# EAGLE schematic itsybitsymo (EAGLE 6.4)
COMPANY: ADAFRUIT INDUSTRIES; DRAWN: KTOWN; REV: B
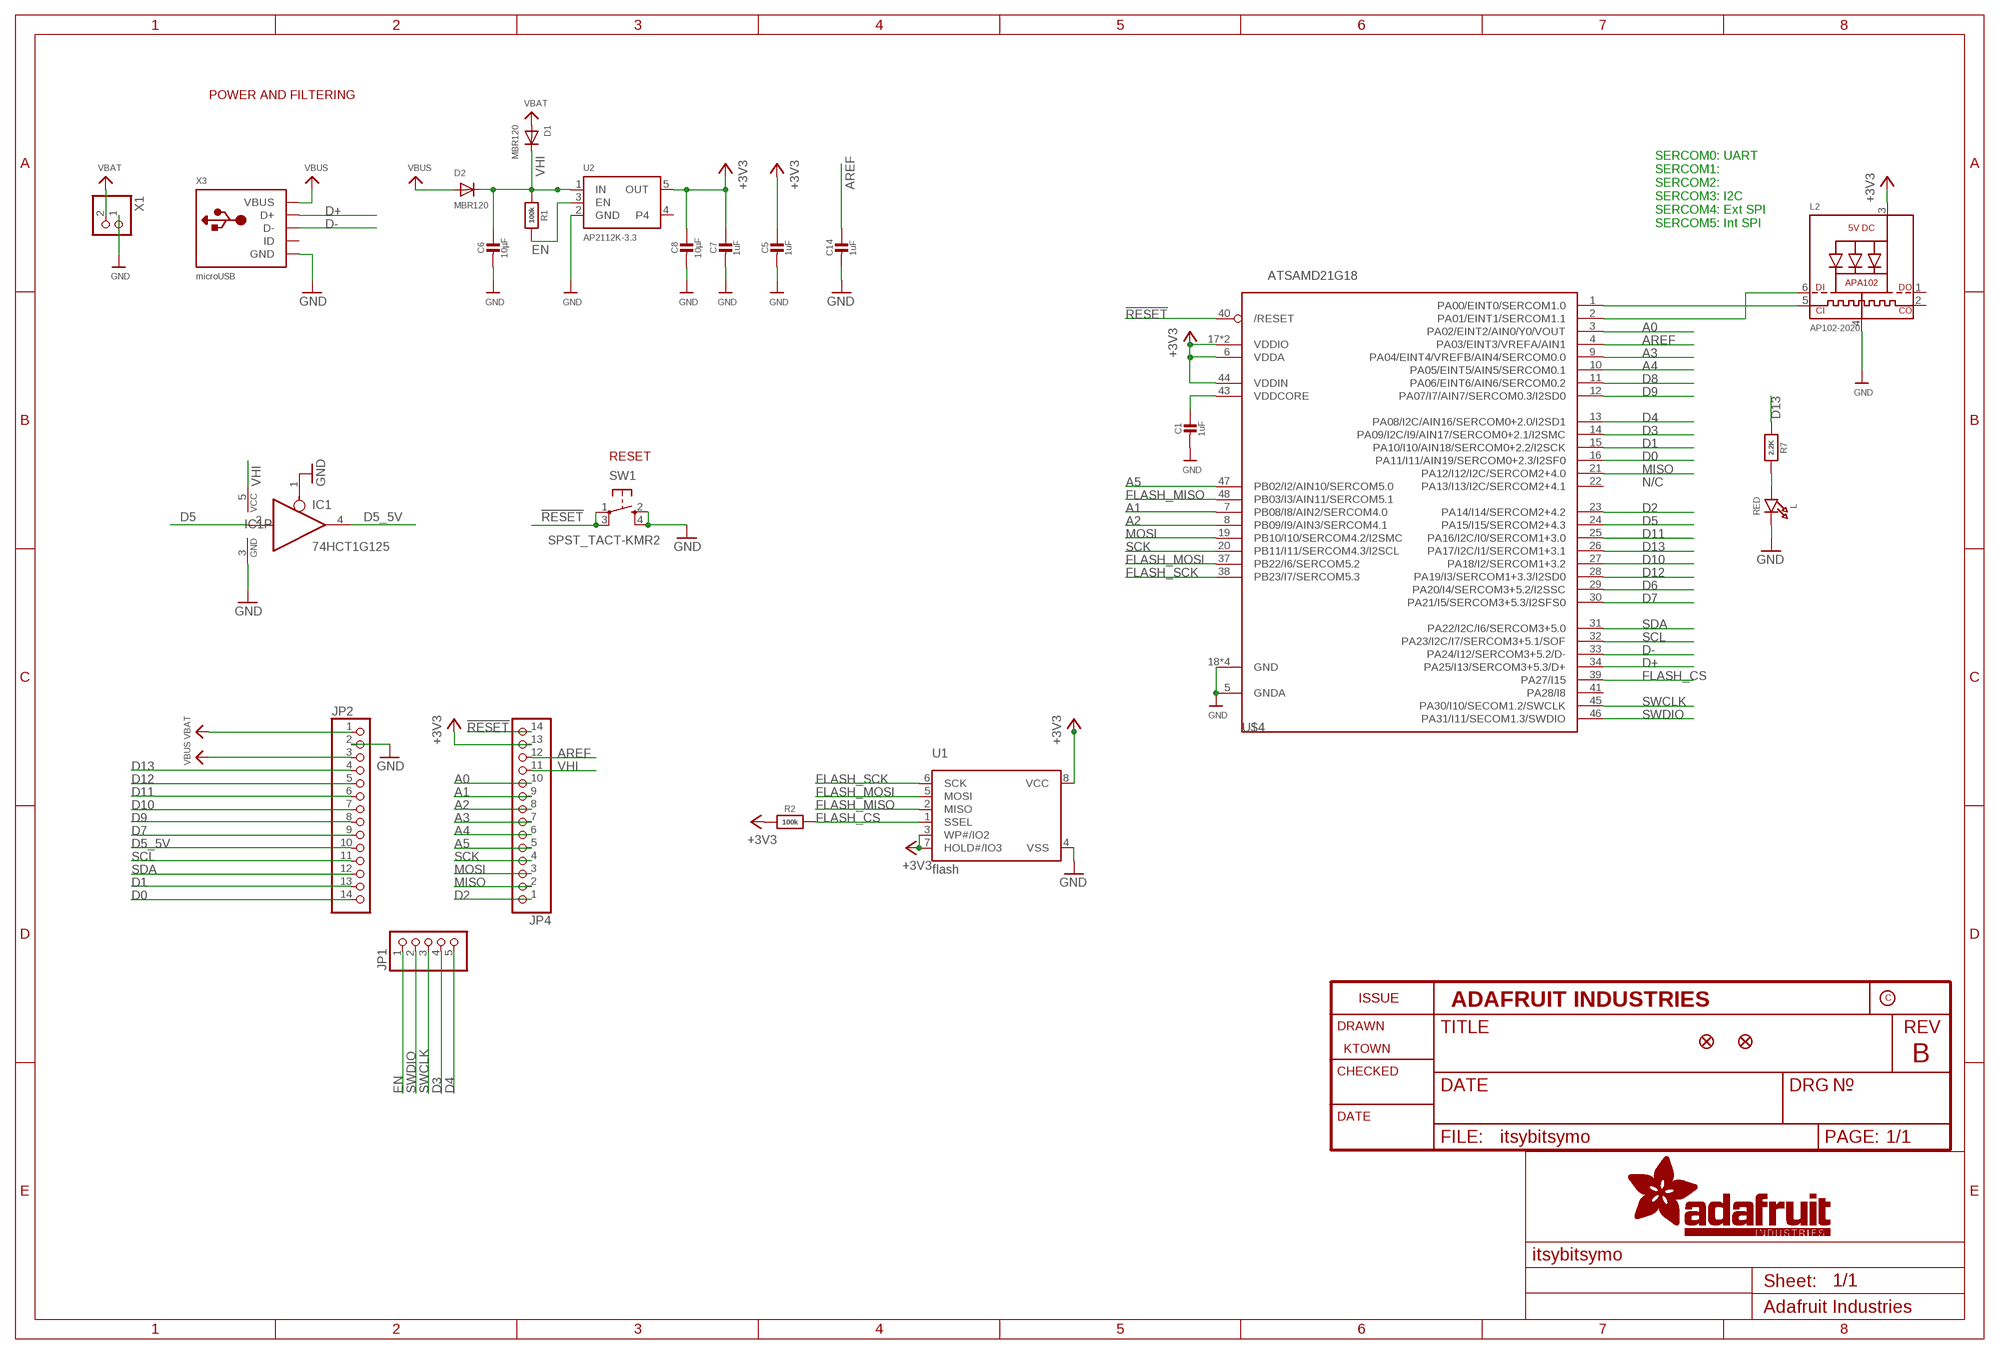
[diagram p0: schematic, sheet 1]

## Parts
C1  1uF  CAP_CERAMIC0603_NO  [0603-NO]
C5  1uF  CAP_CERAMIC0603_NO  [0603-NO]
C6  10µF  CAP_CERAMIC0805-NOOUTLINE  [0805-NO]
C7  1uF  CAP_CERAMIC0603_NO  [0603-NO]
C8  10µF  CAP_CERAMIC0805-NOOUTLINE  [0805-NO]
C14  1uF  CAP_CERAMIC0603_NO  [0603-NO]
D1  MBR120  DIODE_SOD-123FL  [SOD-123FL]
D2  MBR120  DIODE_SOD-123FL  [SOD-123FL]
IC1  74HCT1G125  74AHC1G125DBV  [SOT23-5]
JP1  HEADER-1X570MIL  [1X05_ROUND_70]
JP2  HEADER-1X14  [1X14_ROUND70]
JP4  HEADER-1X14  [1X14_ROUND70]
L  RED  LED0805_NOOUTLINE  [CHIPLED_0805_NOOUTLINE]
L2  AP102-2020  APA1022020  [APA102_2020]
R1  100k  RESISTOR_0603_NOOUT  [0603-NO]
R2  100k  RESISTOR_0603_NOOUT  [0603-NO]
R7  2.2K  RESISTOR_0603_NOOUT  [0603-NO]
SW1  SPST_TACT-KMR2  [KMR2]
U1  flash  SPIFLASH_8PINUX  [USON8]
U2  AP2112K-3.3  VREG_SOT23-5  [SOT23-5]
U$4  ATSAMD21G18  ATSAMD21G_QFN  [TQFN48_7MM]
U$34  FIDUCIAL_1MM  [FIDUCIAL_1MM]
U$35  FIDUCIAL_1MM  [FIDUCIAL_1MM]
X1  CON_JST_PH_2PIN  [JSTPH2]
X3  microUSB  USB_MICRO_20329_V2  [4UCONN_20329_V2]

## Nets
!RESET: JP4.14 SW1.1(P) SW1.3(P1) U$4.40(/RESET)
+3V3: C5.1 C7.1 C8.1 JP4.13 L2.3(VDD) R2.1 U1.3(WP#/IO2) U1.7(HOLD#/IO3) U1.8(VCC) U2.5(OUT) U$4.6(VDDA) U$4.17(VDDIO) U$4.36(VDDIO) U$4.44(VDDIN)
A0: JP4.10 U$4.3(PA02/EINT2/AIN0/Y0/VOUT)
A1: JP4.9 U$4.7(PB08/I8/AIN2/SERCOM4.0)
A2: JP4.8 U$4.8(PB09/I9/AIN3/SERCOM4.1)
A3: JP4.7 U$4.9(PA04/EINT4/VREFB/AIN4/SERCOM0.0)
A4: JP4.6 U$4.10(PA05/EINT5/AIN5/SERCOM0.1)
A5: JP4.5 U$4.47(PB02/I2/AIN10/SERCOM5.0)
AREF: C14.1 JP4.12 U$4.4(PA03/EINT3/VREFA/AIN1)
D0: JP2.14 U$4.16(PA11/I11/AIN19/SERCOM0+2.3/I2SF0)
D1: JP2.13 U$4.15(PA10/I10/AIN18/SERCOM0+2.2/I2SCK)
D2: JP4.1 U$4.23(PA14/I14/SERCOM2+4.2)
D3: JP1.4 U$4.14(PA09/I2C/I9/AIN17/SERCOM0+2.1/I2SMC)
D4: JP1.5 U$4.13(PA08/I2C/AIN16/SERCOM0+2.0/I2SD1)
D5: IC1.2(I) U$4.24(PA15/I15/SERCOM2+4.3)
D5_5V: IC1.4(O) JP2.10
D6: U$4.29(PA20/I4/SERCOM3+5.2/I2SSC)
D7: JP2.9 U$4.30(PA21/I5/SERCOM3+5.3/I2SFS0)
D8: U$4.11(PA06/EINT6/AIN6/SERCOM0.2)
D9: JP2.8 U$4.12(PA07/I7/AIN7/SERCOM0.3/I2SD0)
D10: JP2.7 U$4.27(PA18/I2/SERCOM1+3.2)
D11: JP2.6 U$4.25(PA16/I2C/I0/SERCOM1+3.0)
D12: JP2.5 U$4.28(PA19/I3/SERCOM1+3.3/I2SD0)
D13: JP2.4 R7.1 U$4.26(PA17/I2C/I1/SERCOM1+3.1)
D+: U$4.34(PA25/I13/SERCOM3+5.3/D+) X3.D+
D-: U$4.33(PA24/I12/SERCOM3+5.2/D-) X3.D-
EN: JP1.1 R1.2 U2.3(EN)
FLASH_CS: R2.2 U1.1(SSEL) U$4.39(PA27/I15)
FLASH_MISO: U1.2(MISO) U$4.48(PB03/I3/AIN11/SERCOM5.1)
FLASH_MOSI: U1.5(MOSI) U$4.37(PB22/I6/SERCOM5.2)
FLASH_SCK: U1.6(SCK) U$4.38(PB23/I7/SERCOM5.3)
GND: C1.2 C5.2 C6.2 C7.2 C8.2 C14.2 IC1.1(OE) IC1.3(GND) JP2.2 L2.4(GND) L.C SW1.2(S) SW1.4(S1) U1.4(VSS) U2.2(GND) U$4.5(GNDA) U$4.18(GND) U$4.35(GND) U$4.42(GND) U$4.THERMAL(GND) X1.1 X3.BASE@1(GND) X3.BASE@2(GND) X3.GND X3.SPRT@1(GND) X3.SPRT@2(GND) X3.SPRT@3(GND) X3.SPRT@4(GND)
MISO: JP4.2 U$4.21(PA12/I12/I2C/SERCOM2+4.0)
MOSI: JP4.3 U$4.19(PB10/I10/SERCOM4.2/I2SMC)
N$1: L2.5(CKI) U$4.1(PA00/EINT0/SERCOM1.0)
N$2: L.A R7.2
N$5: L2.6(DI) U$4.2(PA01/EINT1/SERCOM1.1)
SCK: JP4.4 U$4.20(PB11/I11/SERCOM4.3/I2SCL)
SCL: JP2.11 U$4.32(PA23/I2C/I7/SERCOM3+5.1/SOF)
SDA: JP2.12 U$4.31(PA22/I2C/I6/SERCOM3+5.0)
SWCLK: JP1.3 U$4.45(PA30/I10/SECOM1.2/SWCLK)
SWDIO: JP1.2 U$4.46(PA31/I11/SECOM1.3/SWDIO)
VBAT: D1.A JP2.1 X1.2
VBUS: D2.A JP2.3 X3.VBUS
VDDCORE: C1.1 U$4.43(VDDCORE)
VHI: C6.1 D1.C D2.C IC1.5(VCC) JP4.11 R1.1 U2.1(IN)
Unconnected: L2.1(DO) L2.2(CKO) U2.4 U$4.22(PA13/I13/I2C/SERCOM2+4.1) U$4.41(PA28/I8) X3.ID

## Notes on the sheet
- POWER AND FILTERING
- SERCOM0: UART
  SERCOM1:
  SERCOM2:
  SERCOM3: I2C
  SERCOM4: Ext SPI
  SERCOM5: Int SPI
- RESET
- N/C

## Library data of the parts
C1 C5-C8 C14 = microbuilder:CAP_CERAMIC: Ceramic Capacitors For new designs, use the packages preceded by an '_' character since they are more reliable: The following footprints should be used on most boards: _0402 - Standard footprint for regular board layouts _0603 - Standard footprint for regular board layouts _0805 - Standard footprint for regular board layouts _1206 - Standard footprint for regular board layouts For extremely tight-pitch boards where space is at a premium, the following 'micro-pitch' footprints can be used (smaller pads, no silkscreen outline, etc.): _0402MP - Micro-pitch footprint for very dense/compact boards _0603MP - Micro-pitch footprint for very dense/compact boards _0805MP - Micro-pitch footprint for very dense/compact boards _1206MP - Micro-pitch footprint for very dense/compact boards
D1 D2 = adafruit:DIODE: Diode SMADIODE - SMA Surface Mount Package 20V 1A Schottky Diode Digikey: 641-1014-6-ND DO-1N4148 - Through Hole Small Current Diode SOD-123 20V 1 A (.5mV Vf) Schottky Diode - Digikey: MBRX120TPMSCT-ND SOD-323 10V 570mA (.38mV Vf, 3ns) Schottky Diode - Digikey: ZLLS410CT-ND SOD-523 30V 30mA Schottky Diode (RB751S-40TE61) - Digikey: RB751S-40TE61CT-ND SOT23-R/W - SOT23 Package (R = Solder Paste/Reflow Ovens, W = Hand-Soldering) BAT54Film 40V 300mA - Digikey: 497-7162-1-ND
IC1 = 74xx-little-us:74*1G125: Single Bus Buffer Gate with 3-State Output
JP1 = microbuilder:HEADER-1X5: PIN HEADER
JP2 JP4 = microbuilder:HEADER-1X14
L = microbuilder:LED: LED 0603 - 0603 Surface Mount Package 2mA: Green LED - Low Power (3.9mcd, 2ma, 1.7Vf) - Digikey: 475-2709-2-ND Orange LED - Low Power (9.8mcd, 2ma, 1.8Vf) - Digikey: 475-1194-2-ND Red LED - Low Power (5mcd, 2ma, 1.8Vf) - Digikey: 475-1195-2-ND Yellow LED - Low Power (7mcd, 2ma, 1.8Vf) - Digikey: 475-1196-2-ND 5mA: Blue LED - Low Power (17mcd, 5ma, 2.9Vf) - Digikey: LNJ937W8CRACT-ND 0805 - 0805 Surface Mount Package 2mA: Red LED (8.8mcd, 2mA, 1.8Vf, Clear) - Low Power [Digikey: 475-2510-1-ND] Green LED (5mcd, 2mA, 1.8Vf, Clear) - Low Power [Digikey: 475-2730-1-ND] Yellow LED (11.3mcd, 2mA, 1.8Vf, Clear) - Low Power [Digikey: 475-2555-1-ND] 20mA: Red LED (104mcd, 20mA, Diffused) - LS R976 [Digikey: 475-1278-6-ND] Red LED (12mcd, 20mA, 2.0Vf, Clear) - APT2012EC [Digikey: 754-1128-1-ND] Green LED (15mcd, 20mA, 2.2Vf, Clear) - APT2012GC [Digikey: 754-1131-1-ND] Orange LED (160mcd, 20mA, 2.1Vf, Clear) - APT2012SECK [Digikey: 754-1130-1-ND] 1206 - 1206 Surface Mount Package Green LED (26mcd, 20mA, Diffused) - LG N971 [Digikey: 475-1407-6-ND] Red LED (15mcd, 20mA, Diffused) - LH N974 [Digikey: 475-1416-6-ND] Cree - Cree High-Power Surface Mount LEDs XPEBWT-L1-0000-00D50 - White 111lm 350mA 2.9Vf 6200K 110° XTEAWT-00-0000-00000LEE3 - White 114lm 350mA 2.85Vf 5000K 115° Everlight - Everlight 45-21 Series Surface Mount LEDs 45-21/QK2C-B2832AC2CB2/2T - Warm White 2000mcd 20mA 3.25Vf 3050K 120° 45-21/LK2C-B38452C4CB2/2T - Nuetral White 2000mcd 20mA 3.25Vf 4150K 120° 45-21/LK2C-B50634C6CB2/2T - Cold White 2200mcd 20mA 3.25Vf 5650K 120° PLCC2 Reverse Mount LS T77K-J1L2-1-0-2-R18-Z - Red 11.25mcd 2mA 1.8Vf 630nm 120° LO T77K-L1M2-24-Z - Orange 19.6mcd 2mA 1.8Vf 606nm 120° LY T77K-K2M1-26-Z - Yellow 15.7mcd 2mA 1.8Vf 587nm 120°
L2 = microbuilder:APA102: APA102/DotStar Pixels VCC: 5V DC Refresh Rate: 400Hz
R1 R2 R7 = microbuilder:RESISTOR: Resistors For new designs, use the packages preceded by an '_' character since they are more reliable: The following footprints should be used on most boards: _0402 - Standard footprint for regular board layouts _0603 - Standard footprint for regular board layouts _0805 - Standard footprint for regular board layouts _1206 - Standard footprint for regular board layouts For extremely tight-pitch boards where space is at a premium, the following 'micro-pitch' footprints can be used (smaller pads, no silkscreen outline, etc.): _0402MP - Micro-pitch footprint for very dense/compact boards _0603MP - Micro-pitch footprint for very dense/compact boards _0805MP - Micro-pitch footprint for very dense/compact boards _1206MP - Micro-pitch footprint for very dense/compact boards
SW1 = adafruit:SPST_TACT: SMT 6mm switch, EVQQ2 series http://www.ladyada.net/library/eagle
U1 = microbuilder:SPIFLASH_8PIN: SOIC8 SPI Flash Be careful with the size since SOIC8 flash comes in several 'widths' SOIC8 150 mil M25P16 - 16Mbit (2Mbit x 8) Serial Flash (75MHz SPI Bus), Supply: 2.7-3.6V Digikey: SOIC8 - M25P16-VMN6P-ND SOIC8 208 mil W25Q16BVSSIG - 16Mbit (2Mbit x 8) Serial Flash (104MHz SPI Bus), Supply: 2.7-3.6V Digikey: SOIC8 - W25Q16BVSSIG-ND
U2 = microbuilder:VREG_SOT23-5: SOT23-5 Fixed Voltage Regulators Part Current Out V Out V In V Dropout θJA (°C/W) TJ (°C) Digikey Part No. ADP121 150mA 3.3V 3.4-5.5V 0.09V @ 150mA -- -- ADP121-AUJZ33R7CT-ND ADP121 150mA 3.0V 3.1-5.5V 0.09V @ 150mA -- -- ADP121-AUJZ30R7CT-ND ADP122 300mA 3.3V 3.4-5.5V 0.085V @ 300mA -- -- ADP122AUJZ-3.3-R7CT-ND ADP1712 300mA 3.3V 3.5-5.5V 0.17V @ 300mA -- -- ADP1712AUJZ-3.3-R7TR-ND AP7311 (Low Cost) 150mA 3.3V 3.5-6V 0.15V @ 150mA -- -- AP7311-33WG-7DICT-ND LD39015M18R 150mA 1.8V 1.9V-5.5V 0.08V @ 100mA -- -- 497-6977-1-ND LP2985A-33DBVR 150mA 3.3V 3.3-16V 0.28V @ 150mA 206 150 296-18479-1-ND MCP1824T-3302E/OT 300mA 3.3V 3.5V-6V 0.2V @ 300mA -- -- MCP1824T-3302E/OTCT-ND MIC5205-2.5YM5 TR 150mA 2.5V 2.7-16V 0.165V @ 150mA -- -- 576-1257-2-ND MIC5205-3.0YM5 TR 150mA 3.0V 3.2V-16V 0.165V @ 150mA -- -- 576-1258-2-ND MIC5205-3.3YM5 TR 150mA 3.3V 3.5V-16V 0.165V @ 150mA -- -- 576-1259-2-ND TPS780330220 150mA 3.3V+2.2V 3.6-5.5V 250mV Max -- -- 296-23332-1-ND TDA3663/N1,135 100mA 3.3V 3.5-45V 0.18V @ 50mA -- -- 568-5343-1-ND Max operating temp can be calculated using θJA, TJ (max junction temperature), and power in watts. Set the "Maximum Ambient Temperature" until it reaches TJ ("Max Junction Temperature"), which is the absolute limit for safe use of the regulator: Heat Sink Temperature Calculator <http://www.daycounter.com/Calculators/Heat-Sink-Temperature-Calculator.phtml> For example, With 12V source into a 3.3V LP2985 and a 30mA load, we are dissipating (12V-3.3V) * 0.03A = 0.261W. With a θJA of 206 °C/W, a TJ of 150°C, and 261mW we can safely use the chip without a heat sink up to 75°C (=147.1°C Junction Temperature).
U$4 = microbuilder:ATSAMD21G
U$34 U$35 = microbuilder:FIDUCIAL: Fiducial Alignment Points Various fiducial points for machine vision alignment.; BOM: EXCLUDE
X1 = microbuilder:CON_JST_PH_2PIN: JST 2-Pin Right-Angle Connector PH-Series - 4UConnector: 17311 SH-Series - 4UConnector: 07278
X3 = microbuilder:USB: USB Connectors USBMINIB - Surface Mount Female Mini-B USB Connector 4UConnector: 06564